# Altium project Remote_Control_Project.PrjPcb
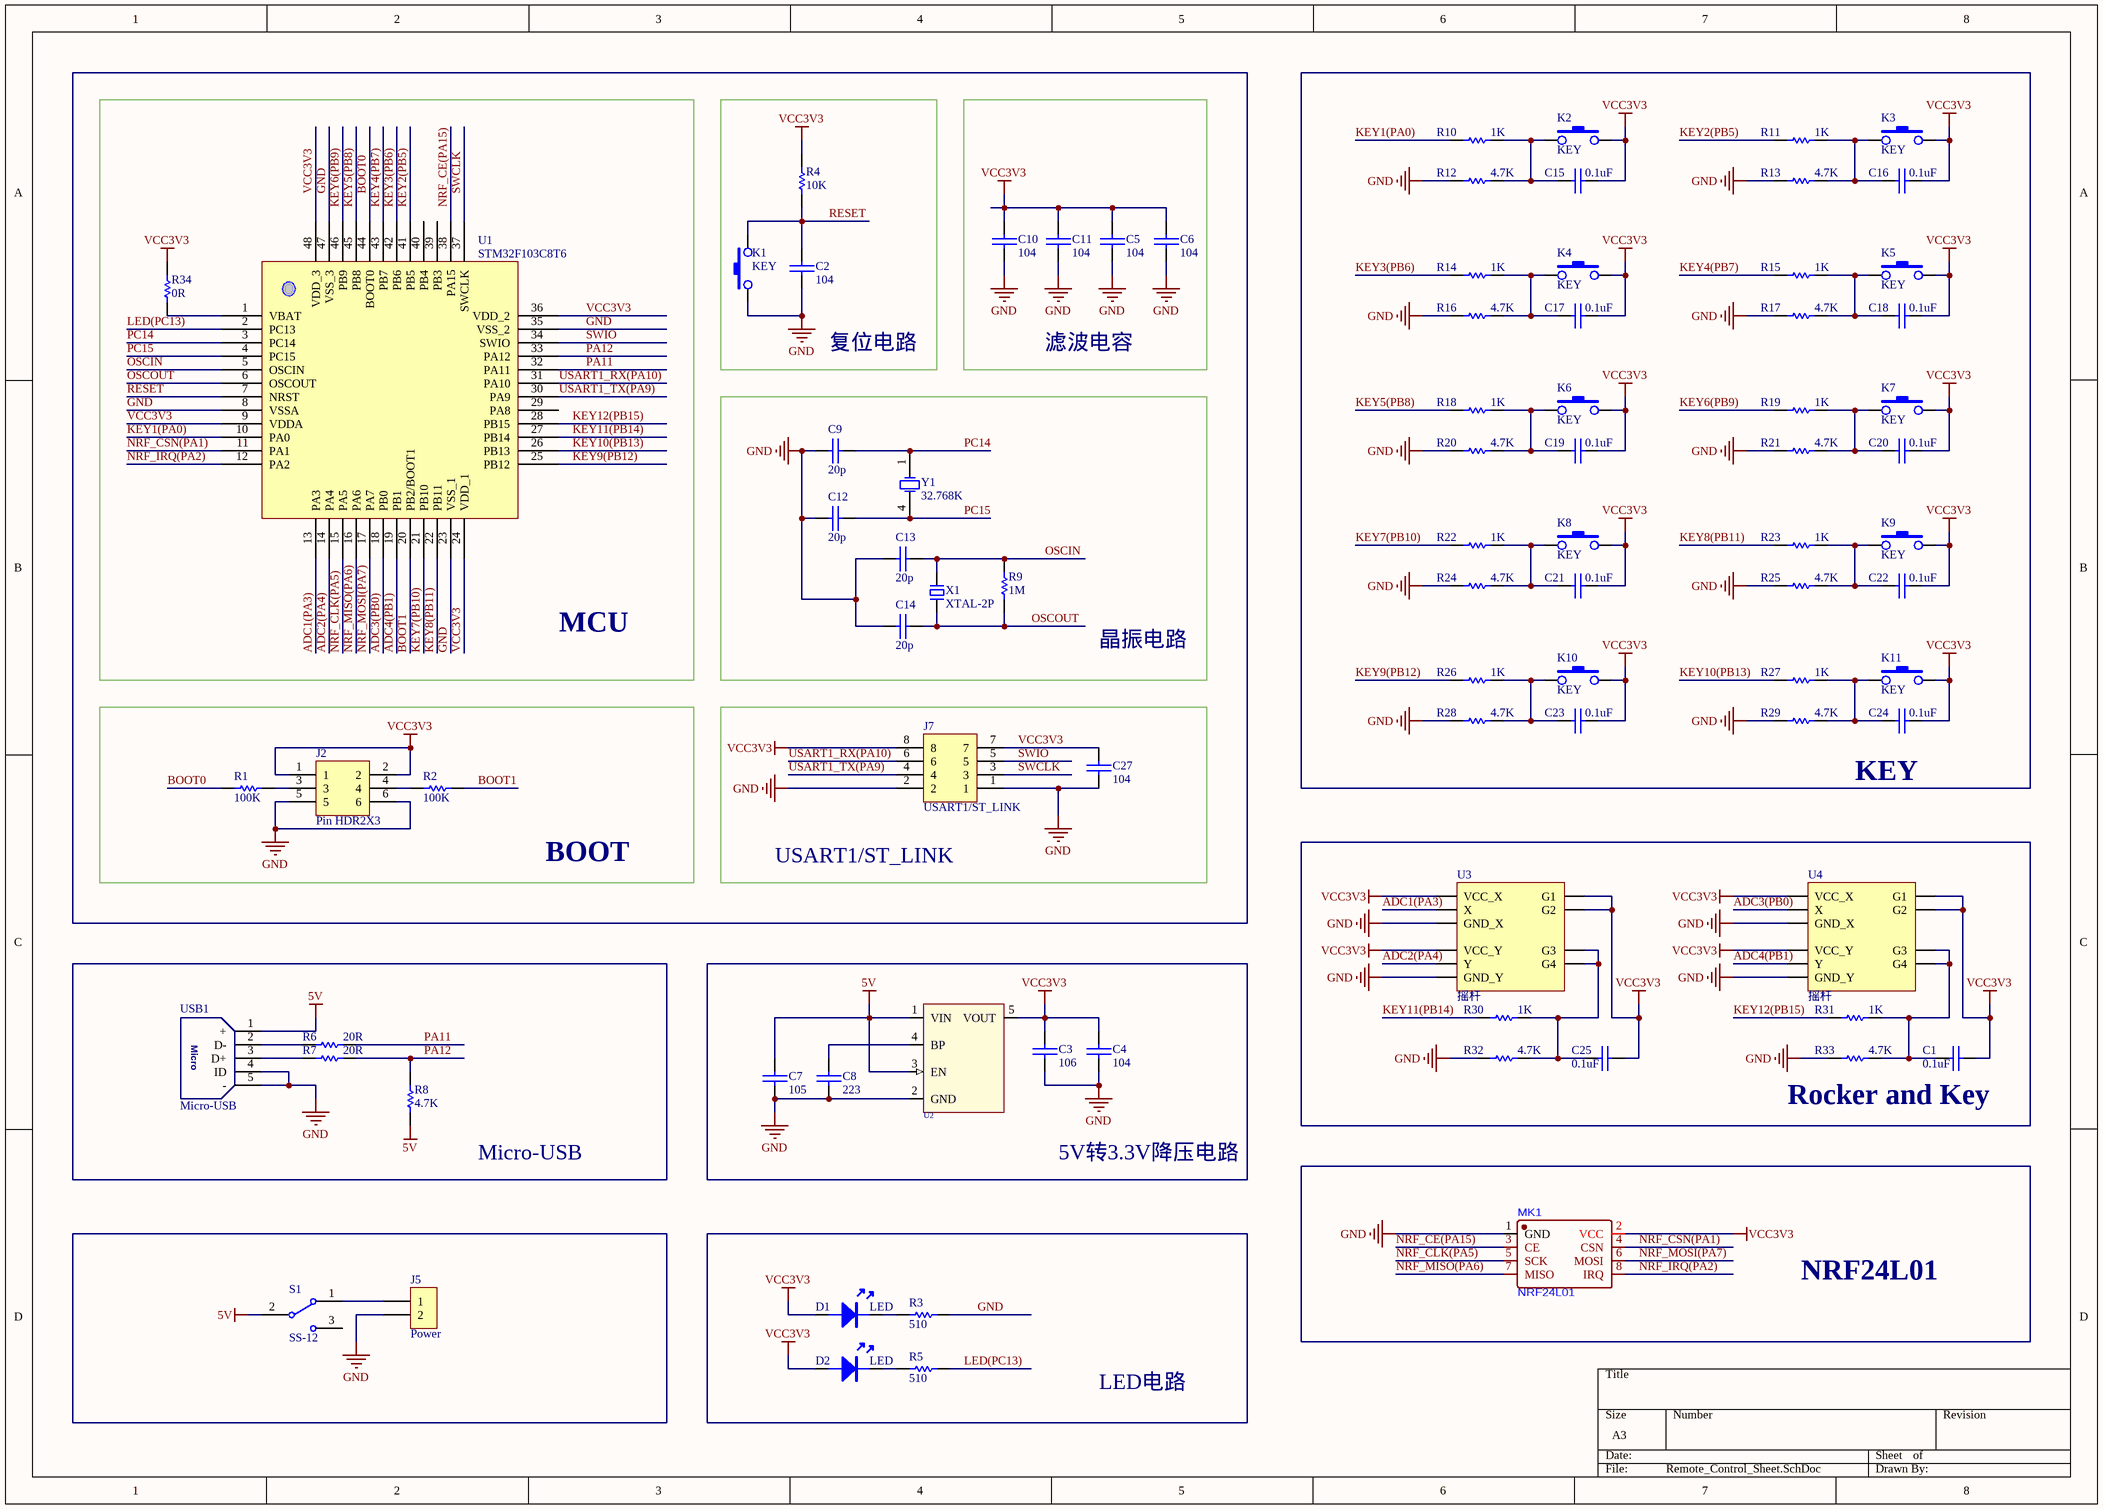
[diagram p0: Remote_Control_Sheet.SchDoc]
1 sheet, 85 parts. Net scope: global (net labels, ports and power ports of the same name join across sheets).
Board file: Remote_Control_PCB.PcbDoc

## Sheet Remote_Control_Sheet.SchDoc
size A3

### Parts
C1  0.1uF  [0603C]
C2  104  [0603C]
C3  106  [0603C]
C4  104  [0603C]
C5  104  [0603C]
C6  104  [0603C]
C7  105  [0603C]
C8  223  [0603C]
C9  20p  [0603C]
C10  104  [0603C]
C11  104  [0603C]
C12  20p  [0603C]
C13  20p  [0603C]
C14  20p  [0603C]
C15  0.1uF  [0603C]
C16  0.1uF  [0603C]
C17  0.1uF  [0603C]
C18  0.1uF  [0603C]
C19  0.1uF  [0603C]
C20  0.1uF  [0603C]
C21  0.1uF  [0603C]
C22  0.1uF  [0603C]
C23  0.1uF  [0603C]
C24  0.1uF  [0603C]
C25  0.1uF  [0603C]
C27  104  [0603C]
D1  LED  [LED-0603B]
D2  LED  [LED-0603B]
J2  Pin HDR2X3  [Pin HDR2X3/2.54mm-S]
J5  Power  [Pin HDR1X2/2.54mm-S]
J7  USART1/ST_LINK  [Pin HDR2X4/2.54mm-S]
K1  KEY  [SMD-3X6X5]
K2  KEY  [SMD-3X6X2.5]
K3  KEY  [SMD-3X6X2.5]
K4  KEY  [SMD-3X6X2.5]
K5  KEY  [SMD-3X6X2.5]
K6  KEY  [SMD-3X6X2.5]
K7  KEY  [SMD-3X6X2.5]
K8  KEY  [SMD-3X6X2.5]
K9  KEY  [SMD-3X6X2.5]
K10  KEY  [SMD-3X6X2.5]
K11  KEY  [SMD-3X6X2.5]
MK1  NRF24L01  [WIRELM-SMD_NRF24L01]
R1  100K  [0603R]
R2  100K  [0603R]
R3  510  [0603R]
R4  10K  [0603R]
R5  510  [0603R]
R6  20R  [0603R]
R7  20R  [0603R]
R8  4.7K  [0603R]
R9  1M  [0603R]
R10  1K  [0603R]
R11  1K  [0603R]
R12  4.7K  [0603R]
R13  4.7K  [0603R]
R14  1K  [0603R]
R15  1K  [0603R]
R16  4.7K  [0603R]
R17  4.7K  [0603R]
R18  1K  [0603R]
R19  1K  [0603R]
R20  4.7K  [0603R]
R21  4.7K  [0603R]
R22  1K  [0603R]
R23  1K  [0603R]
R24  4.7K  [0603R]
R25  4.7K  [0603R]
R26  1K  [0603R]
R27  1K  [0603R]
R28  4.7K  [0603R]
R29  4.7K  [0603R]
R30  1K  [0603R]
R31  1K  [0603R]
R32  4.7K  [0603R]
R33  4.7K  [0603R]
R34  0R  [0603R]
S1  SS-12  [SK-12D07VG3]
U1  STM32F103C8T6  [48P]
U2  RT9193  [SOT-23-5]  (value not drawn)
U3  摇杆  [摇杆_直插_圆半径13_10电气脚_4固定脚]
U4  摇杆  [摇杆_直插_圆半径13_10电气脚_4固定脚]
USB1  Micro-USB  [USB-MICRO_A]
X1  XTAL-2P  [OSC HC-49S]
Y1  32.768K  [MC-306]

### Nets
5V: C7.2 R8.2 S1.2 U2.1(VIN) U2.3(EN) USB1.1(+)
GND: C2.1 C3.1 C4.1 C5.1 C6.1 C7.1 C8.1 C9.1 C10.1 C11.1 C12.1 C13.1 C14.1 C27.1 J2.5 J2.6 J5.2 J7.1 J7.2 K1.1 MK1.1(GND) R3.1 R12.1 R13.1 R16.1 R17.1 R20.1 R21.1 R24.1 R25.1 R28.1 R29.1 R32.1 R33.1 U1.8(VSSA) U1.23(VSS_1) U1.35(VSS_2) U1.47(VSS_3) U2.2(GND) U3.7(GND_X) U3.10(GND_Y) U4.7(GND_X) U4.10(GND_Y) USB1.4(ID) USB1.5(-)
VCC3V3: C1.2 C3.2 C4.2 C5.2 C6.2 C10.2 C11.2 C15.2 C16.2 C17.2 C18.2 C19.2 C20.2 C21.2 C22.2 C23.2 C24.2 C25.2 C27.2 D1.A D2.A J2.1 J2.2 J7.7 J7.8 K2.3 K3.3 K4.3 K5.3 K6.3 K7.3 K8.3 K9.3 K10.3 K11.3 MK1.2(VCC) R4.2 R34.2 U1.9(VDDA) U1.24(VDD_1) U1.36(VDD_2) U1.48(VDD_3) U2.5(VOUT) U3.1(G1) U3.2(G2) U3.5(VCC_X) U3.8(VCC_Y) U4.1(G1) U4.2(G2) U4.5(VCC_X) U4.8(VCC_Y)
ADC1(PA3): U1.13(PA3) U3.6(X)
ADC2(PA4): U1.14(PA4) U3.9(Y)
ADC3(PB0): U1.18(PB0) U4.6(X)
ADC4(PB1): U1.19(PB1) U4.9(Y)
BOOT0: R1.2 U1.44(BOOT0)
BOOT1: R2.1 U1.20(PB2/BOOT1)
KEY1(PA0): R10.1 U1.10(PA0)
KEY2(PB5): R11.1 U1.41(PB5)
KEY3(PB6): R14.1 U1.42(PB6)
KEY4(PB7): R15.1 U1.43(PB7)
KEY5(PB8): R18.1 U1.45(PB8)
KEY6(PB9): R19.1 U1.46(PB9)
KEY7(PB10): R22.1 U1.21(PB10)
KEY8(PB11): R23.1 U1.22(PB11)
KEY9(PB12): R26.1 U1.25(PB12)
KEY10(PB13): R27.1 U1.26(PB13)
KEY11(PB14): R30.1 U1.27(PB14)
KEY12(PB15): R31.1 U1.28(PB15)
LED(PC13): R5.1 U1.2(PC13)
NRF_CE(PA15): MK1.3(CE) U1.38(PA15)
NRF_CLK(PA5): MK1.5(SCK) U1.15(PA5)
NRF_CSN(PA1): MK1.4(CSN) U1.11(PA1)
NRF_IRQ(PA2): MK1.8(IRQ) U1.12(PA2)
NRF_MISO(PA6): MK1.7(MISO) U1.16(PA6)
NRF_MOSI(PA7): MK1.6(MOSI) U1.17(PA7)
OSCIN: C13.2 R9.1 U1.5(OSCIN) X1.2
OSCOUT: C14.2 R9.2 U1.6(OSCOUT) X1.1
PA11: R6.1 U1.32(PA11)
PA12: R7.1 R8.1 U1.33(PA12)
PC14: C9.2 U1.3(PC14) Y1.1(OSC1)
PC15: C12.2 U1.4(PC15) Y1.4(OSC2)
RESET: C2.2 K1.3 R4.1 U1.7(NRST)
SWCLK: J7.3 U1.37(SWCLK)
SWIO: J7.5 U1.34(SWIO)
USART1_RX(PA10): J7.6 U1.31(PA10)
USART1_TX(PA9): J7.4 U1.30(PA9)
NetC1_1: C1.1 R31.2 R33.2 U4.3(G3) U4.4(G4)
NetC8_2: C8.2 U2.4(BP)
NetC15_1: C15.1 K2.1 R10.2 R12.2
NetC16_1: C16.1 K3.1 R11.2 R13.2
NetC17_1: C17.1 K4.1 R14.2 R16.2
NetC18_1: C18.1 K5.1 R15.2 R17.2
NetC19_1: C19.1 K6.1 R18.2 R20.2
NetC20_1: C20.1 K7.1 R19.2 R21.2
NetC21_1: C21.1 K8.1 R22.2 R24.2
NetC22_1: C22.1 K9.1 R23.2 R25.2
NetC23_1: C23.1 K10.1 R26.2 R28.2
NetC24_1: C24.1 K11.1 R27.2 R29.2
NetC25_1: C25.1 R30.2 R32.2 U3.3(G3) U3.4(G4)
NetD1_K: D1.K R3.2
NetD2_K: D2.K R5.2
NetJ2_3: J2.3 R1.1
NetJ2_4: J2.4 R2.2
NetJ5_1: J5.1 S1.1
NetR6_2: R6.2 USB1.2(D-)
NetR7_2: R7.2 USB1.3(D+)
NetR34_1: R34.1 U1.1(VBAT)

Not connected (* = marked no-connect by the designer): S1 3; U1 29(PA8) 39(PB3) 40(PB4)

### Notes on the sheet
- 复位电路
- 滤波电容
- MCU
- 晶振电路
- KEY
- BOOT
- USART1/ST_LINK
- Rocker and Key
- Micro-USB
- 5V转3.3V降压电路
- NRF24L01
- LED电路
- (in symbol Micro-USB) Micro

### Library data of the parts
C1-C25 C27 = CAP: 无极性电容
J5 = Pin HDR1X2
J7 = Pin HDR2X4
R1-R34 = RES
S1 = SS-12X
U2 = RT9193X_5P: ICA_MFR_NAME: RICHTEK; ICA_PARTNUM: $$2191094$$RT9193-15CU5; Part Number: TMP-13
X1 = XTAL-2P: 2脚无源脚晶振
Y1 = XTAL: Crystal Oscillator; Published: 8-Jun-2000; LatestRevisionDate: 17-Jul-2002; LatestRevisionNote: Re-released for DXP Platform.; Publisher: Altium Limited